# EAGLE schematic Ds3231Shield (EAGLE 7.4.0)
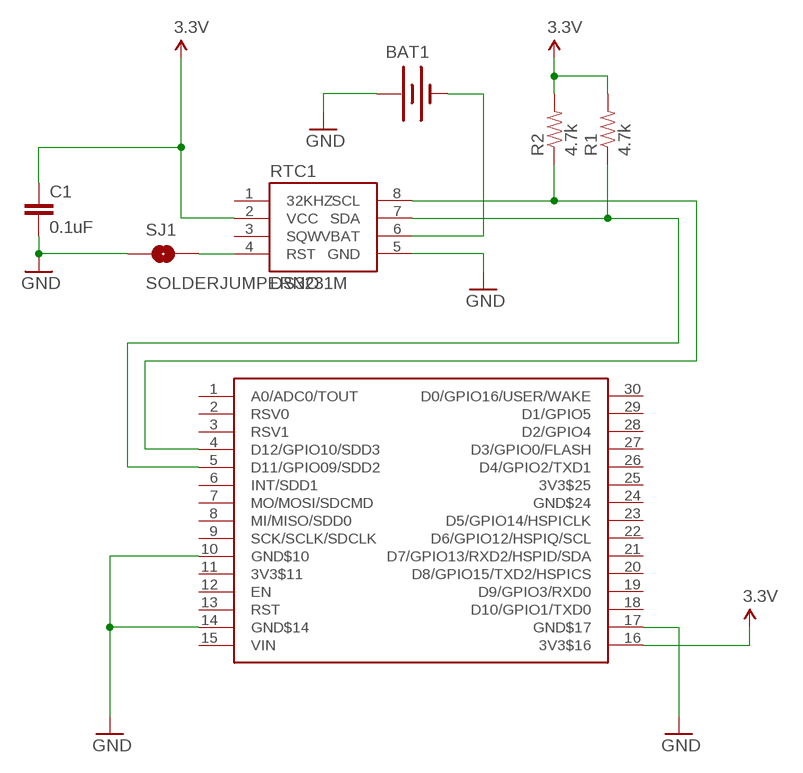
[diagram p0: schematic, sheet 1]

## Parts
BAT1  BATTERY12MM  [BATTCON_12MM]
C1  0.1uF  CAP0402-CAP  [0402-CAP]
R1  4.7k  RESISTOR0402-RES  [0402-RES]
R2  4.7k  RESISTOR0402-RES  [0402-RES]
RTC1  DS3231M  [SOIC8]
SJ1  SOLDERJUMPERNO  [SJ_2S-NO]
U$1  NERDSHIELD  [NERDUINO_STACK]

## Nets
3.3V: C1.1 R1.2 R2.2 RTC1.2(VCC) U$1.16(3V3$16)
GND: BAT1.PWR@1(+) C1.2 RTC1.5(GND) SJ1.1 U$1.10(GND$10) U$1.14(GND$14) U$1.17(GND$17)
N$1: BAT1.GND(-) RTC1.6(VBAT)
N$2: R2.1 RTC1.8(SCL) U$1.4(D12/GPIO10/SDD3)
N$3: R1.1 RTC1.7(SDA) U$1.5(D11/GPIO09/SDD2)
N$4: RTC1.4(RST) SJ1.2
Unconnected: RTC1.1(32KHZ) RTC1.3(SQW) U$1.1(A0/ADC0/TOUT) U$1.2(RSV0) U$1.3(RSV1) U$1.6(INT/SDD1) U$1.7(MO/MOSI/SDCMD) U$1.8(MI/MISO/SDD0) U$1.9(SCK/SCLK/SDCLK) U$1.11(3V3$11) U$1.12(EN) U$1.13(RST) U$1.15(VIN) U$1.18(D10/GPIO1/TXD0) U$1.19(D9/GPIO3/RXD0) U$1.20(D8/GPIO15/TXD2/HSPICS) U$1.21(D7/GPIO13/RXD2/HSPID/SDA) U$1.22(D6/GPIO12/HSPIQ/SCL) U$1.23(D5/GPIO14/HSPICLK) U$1.24(GND$24) U$1.25(3V3$25) U$1.26(D4/GPIO2/TXD1) U$1.27(D3/GPIO0/FLASH) U$1.28(D2/GPIO4) U$1.29(D1/GPIO5) U$1.30(D0/GPIO16/USER/WAKE)

## Library data of the parts
BAT1 = SparkFun-Electromechanical:BATTERY: Battery Holders Various common sizes : AA, AAA, 18650 (PRT-12895), 20mm coin cell and 12mm coin cell. 20MM_4LEGS, BATT-10373; PROD_ID: BATT-08044
C1 = SparkFun:CAP: Capacitor Standard 0603 ceramic capacitor, and 0.1" leaded capacitor.
R1 R2 = SparkFun:RESISTOR: Resistor Basic schematic elements and footprints for 0603, 1206, and PTH resistors.
RTC1 = SparkFun-DigitalIC:DS3231M: DS3231M Real Time Clock. Accuracy +/-5ppm. Battery Backup. 2.3V to 5.5V.; PROD_ID: IC-11985
SJ1 = SparkFun:SOLDERJUMPER: Solder Jumper Standard SMD solder jumper. Used to automate production. Two varients : Normally Open and Normally Closed are the same, but have different paste layers. NC will have a large amount of paste and should jumper during reflow.
U$1 = NerduinoShieldLib:NERDSHIELD